# Altium schematic sheet BP_Schematic.SchDoc
size A3; SheetNumber: 1; SheetTotal: 1
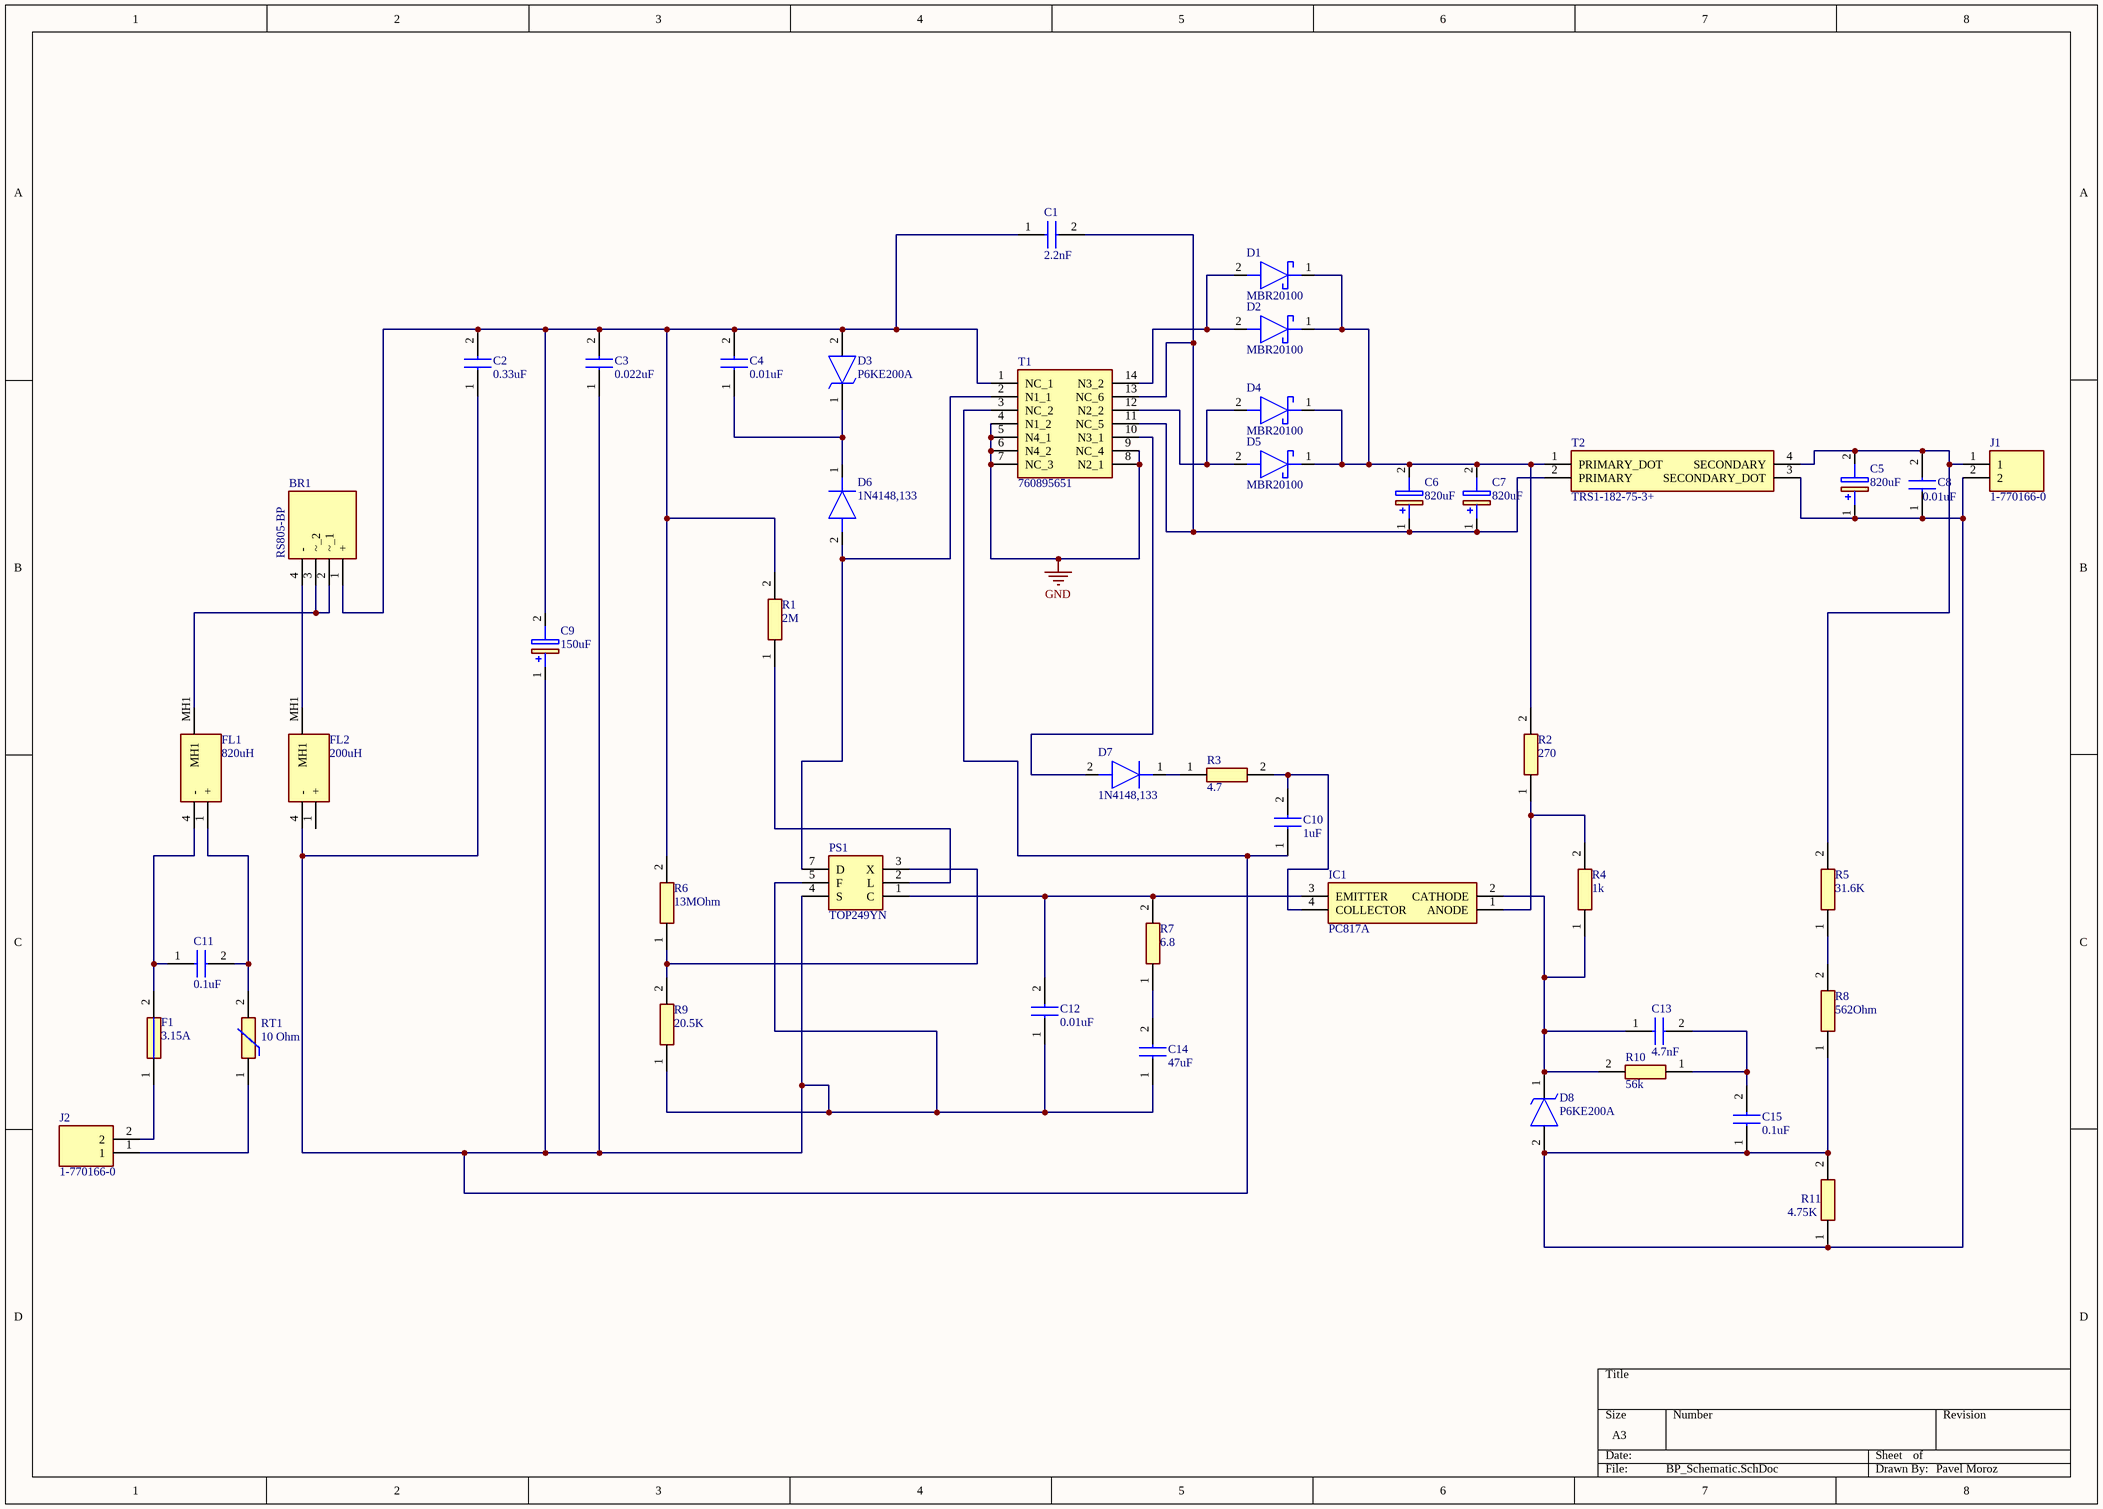
[diagram p0: BP_Schematic.SchDoc]

## Parts
BR1  RS805-BP  [RS805BP]
C1  2.2nF  [GRM21x]
C2  0.33uF  [CAPC9863X510N]
C3  0.022uF  [ECHU_E1_E2_E3_E3a_4]
C4  0.01uF  [GRM21x]
C5  820uF  [T520H]
C6  820uF  [T520H]
C7  820uF  [T520H]
C8  0.01uF  [GRM21x]
C9  150uF  [CAPPM7343X310N]
C10  1uF  [ECQE4105KF]
C11  0.1uF  [CAPC2012X135N]
C12  0.01uF  [GRM21x]
C13  4.7nF  [B32652_(18_x_6)]
C14  47uF  [KR355WD7LG274MH01L]
C15  0.1uF  [B32652_(18_x_6)]
D1  MBR20100  [TO508P485X1018X1930-2P]
D2  MBR20100  [TO508P485X1018X1930-2P]
D3  P6KE200A  [DIOAD1936W88L640D324]
D4  MBR20100  [TO508P485X1018X1930-2P]
D5  MBR20100  [TO508P485X1018X1930-2P]
D6  1N4148,133  [DIOAD1165W56L425D185]
D7  1N4148,133  [DIOAD1165W56L425D185]
D8  P6KE200A  [DIOAD1936W88L640D324]
F1  3.15A  [FUSC12145X450N]
FL1  820uH  [DMT220038L]
FL2  200uH  [DMT220038L]
IC1  PC817A  [DIP762W60P254L458H450Q4N]
J1  1-770166-0  [17701660]
J2  1-770166-0  [17701660]
PS1  TOP249YN  [TOP249YN]
R1  2M  [ERA2AED122X]
R2  270  [ERA2AED122X]
R3  4.7  [ERA3AEB101V]
R4  1k  [ERJUP6]
R5  31.6K  [RESC1005X37N]
R6  13MOhm  [RESC1608X55N]
R7  6.8  [ERA3AEB101V]
R8  562Ohm  [ERJUP6]
R9  20.5K  [ERA2AED122X]
R10  56k  [ERJUP6]
R11  4.75K  [ERA3AEB101V]
RT1  10 Ohm  [10D207LD]
T1  760895651  [760895651]
T2  TRS1-182-75-3+  [TRS1182753]

## Nets
GND: T1.4(N1_2) T1.5(N4_1) T1.6(N4_2) T1.7(NC_3) T1.8(N2_1) T1.9(NC_4)
NetBR1_1: BR1.1(+) C1.1 C2.2 C3.2 C4.2 C9.2(-) D3.2(A) R1.2 R6.2 T1.1(NC_1)
NetBR1_2: BR1.2(~_1) BR1.3(~_2) FL1.MH1
NetBR1_4: BR1.4(-) FL2.MH1
NetC1_2: C1.2 C6.1(+) C7.1(+) T1.11(NC_5) T1.13(NC_6) T2.2(PRIMARY)
NetC2_1: C2.1 C3.1 C9.1(+) C10.1 C12.1 C14.1 FL2.4(-) PS1.4(S) PS1.5(F) R9.1 T1.3(NC_2)
NetC4_1: C4.1 D3.1(K) D6.1(K)
NetC5_1: C5.1(+) C8.1 C15.1 D8.2(A) J1.2 R8.1 R11.1 R11.2 T2.3(SECONDARY_DOT)
NetC5_2: C5.2(-) C8.2 J1.1 R5.2 T2.4(SECONDARY)
NetC6_2: C6.2(-) C7.2(-) D1.1(K) D2.1(K) D4.1(K) D5.1(K) R2.2 T2.1(PRIMARY_DOT)
NetC10_2: C10.2 IC1.4(COLLECTOR) R3.2
NetC11_1: C11.1 F1.2 FL1.4(-)
NetC11_2: C11.2 FL1.1(+) RT1.2
NetC12_2: C12.2 IC1.3(EMITTER) PS1.1(C) R7.2
NetC13_1: C13.1 D8.1(K) IC1.2(CATHODE) R4.1 R10.2
NetC13_2: C13.2 C15.2 R10.1
NetC14_2: C14.2 R7.1
NetD1_2: D1.2(A) D2.2(A) T1.14(N3_2)
NetD4_2: D4.2(A) D5.2(A) T1.12(N2_2)
NetD6_2: D6.2(A) PS1.7(D) T1.2(N1_1)
NetD7_1: D7.1(K) R3.1
NetD7_2: D7.2(A) T1.10(N3_1)
NetF1_1: F1.1 J2.2
NetIC1_1: IC1.1(ANODE) R2.1 R4.2
NetJ2_1: J2.1 RT1.1
NetPS1_2: PS1.2(L) R1.1
NetPS1_3: PS1.3(X) R6.1 R9.2
NetR5_1: R5.1 R8.2

Not connected (* = marked no-connect by the designer): FL2 1(+)

## Notes on the sheet
- Pavel Moroz

## Library data of the parts
BR1 = RS805-BP: Bridge Rectifier; Manufacturer_Name: MCC; Datasheet Link: https://www.mccsemi.com/pdf/Products/RS801-RS807(RS-6).pdf; Height: 19.3mm; Manufacturer_Part_Number: RS805-BP
C1 C4 C8 C12 = GRM21A5C2E222FWA1J: Capacitor; Manufacturer_Name: Murata Electronics; Datasheet Link: https://search.murata.co.jp/Ceramy/image/img/A01X/G101/ENG/GRM21A5C2E222FWA1-01.pdf; Height: 1.25mm; Manufacturer_Part_Number: GRM21A5C2E222FWA1J; Mouser Part Number: 81-RM21A5C2E222FWA1J; Mouser Price/Stock: https://www.mouser.co.uk/ProductDetail/Murata-Electronics/GRM21A5C2E222FWA1J?qs=81r%252BiQLm7BSiEikPutdFnA%3D%3D
C2 = ECW-U2334KCV: Capacitor; Manufacturer_Name: Panasonic; Datasheet Link: https://4donline.ihs.com/images/VipMasterIC/IC/PANA/PANAS16556/PANAS16556-1.pdf?hkey=52A5661711E402568146F3353EA87419; Height: 5.1mm; Manufacturer_Part_Number: ECW-U2334KCV; Mouser Part Number: 667-ECW-U2334KCV; Mouser Price/Stock: https://www.mouser.co.uk/ProductDetail/Panasonic/ECW-U2334KCV?qs=2eTIFwEe529usYuiaSX9EA%3D%3D
C3 = ECW-U2223JC9: Capacitor; Manufacturer_Name: Panasonic; Datasheet Link: http://industrial.panasonic.com/cdbs/www-data/pdf/RDI0000/ABD0000C176.pdf; Manufacturer_Part_Number: ECW-U2223JC9; Mouser Part Number: 667-ECW-U2223JC9; Mouser Price/Stock: https://www.mouser.com/Search/Refine.aspx?Keyword=667-ECW-U2223JC9
C5-C7 = T520H827M010ATE070: Capacitor Polarised; Manufacturer_Name: KEMET; Datasheet Link: https://content.kemet.com/datasheets/KEM_T2076_T52X-530.pdf; Height: 2mm; Manufacturer_Part_Number: T520H827M010ATE070; Mouser Part Number: 80-T520H827M010ATE70; Mouser Price/Stock: https://www.mouser.co.uk/ProductDetail/KEMET/T520H827M010ATE070?qs=f9yNj16SXrKlZOF3KavohA%3D%3D; Arrow Part Number: T520H827M010ATE070; Arrow Price/Stock: https://www.arrow.com/en/products/t520h827m010ate070/kemet-corporation
C9 = 593D157X0010D2TE3: Capacitor Polarised; Manufacturer_Name: Vishay; Datasheet Link: http://www.vishay.com/doc?40005; Height: 3.1mm; Manufacturer_Part_Number: 593D157X0010D2TE3; Mouser Part Number: 74-593D157X0010D2TE3; Mouser Price/Stock: https://www.mouser.co.uk/ProductDetail/Vishay-Sprague/593D157X0010D2TE3?qs=aQP3sjJQQ7Wdjntmkm5NMA%3D%3D
C10 = ECQ-E4105KF: Capacitor; Manufacturer_Name: Panasonic; Datasheet Link: https://industrial.panasonic.com/cdbs/www-data/pdf/RDI0000/ABD0000C179.pdf; Height: 18mm; Manufacturer_Part_Number: ECQ-E4105KF; Mouser Part Number: 667-ECQ-E4105KF; Mouser Price/Stock: https://www.mouser.co.uk/ProductDetail/Panasonic/ECQ-E4105KF?qs=FaGJejDeu%252B%2Fy%2Fa6s5CifsQ%3D%3D; Arrow Part Number: ECQ-E4105KF; Arrow Price/Stock: https://www.arrow.com/en/products/ecq-e4105kf/panasonic?region=nac
C11 = MAASU21GSB7104MTCA01: Capacitor; Manufacturer_Name: TAIYO YUDEN; Datasheet Link: https://ds.yuden.co.jp/TYCOMPAS/ap/detail?pn=MAASU21GSB7104MTCA01&u=M; Height: 1.35mm; Manufacturer_Part_Number: MAASU21GSB7104MTCA01; Mouser Part Number: 963-MAASU21GSB7104M; Mouser Price/Stock: https://www.mouser.co.uk/ProductDetail/TAIYO-YUDEN/MAASU21GSB7104MTCA01?qs=HFfMDpzxxd3%252BHMM46uQdgg%3D%3D
C13 C15 = B32652A1472J000: Capacitor; Manufacturer_Name: TDK; Datasheet Link: https://product.tdk.com/system/files/dam/doc/product/capacitor/film/mkp_mfp/data_sheet/20/20/db/fc_2009/mkp_b32651_658.pdf; Height: 11mm; Manufacturer_Part_Number: B32652A1472J000; Mouser Part Number: 871-B32652A1472J; Mouser Price/Stock: https://www.mouser.co.uk/ProductDetail/EPCOS-TDK/B32652A1472J000?qs=Ff9BYJREiZ5d5E3KH0oh6g%3D%3D
C14 = KRM55WR71H476MH13L: Capacitor; Manufacturer_Name: Murata Electronics; Datasheet Link: https://search.murata.co.jp/Ceramy/image/img/A01X/G101/ENG/KRM55_25V-100V_E.pdf; Manufacturer_Part_Number: KRM55WR71H476MH13L; Mouser Part Number: 81-KRM55WR71H476MH13; Mouser Price/Stock: https://www.mouser.co.uk/ProductDetail/Murata-Electronics/KRM55WR71H476MH13L?qs=xZFQr2mActd1GTa%252BXqK0VQ%3D%3D
D1 D2 D4 D5 = MBR20100: Schottky Diode; Manufacturer_Name: SMC Diode Solutions; Datasheet Link: http://www.smc-diodes.com/propdf/MBR20100%20N0759%20REV.B.pdf; Height: 4.85mm; Manufacturer_Part_Number: MBR20100
D3 D8 = P6KE200A: TVS Diode (Uni-directional); Manufacturer_Name: STMicroelectronics; Datasheet Link: http://www.st.com/web/en/resource/technical/document/datasheet/CD00000720.pdf; Manufacturer_Part_Number: P6KE200A; Mouser Part Number: 511-P6KE200A; Mouser Price/Stock: https://www.mouser.co.uk/ProductDetail/STMicroelectronics/P6KE200A?qs=1B3Q%2FtOggyyKpgFymH4LMw%3D%3D; Arrow Part Number: P6KE200A; Arrow Price/Stock: https://www.arrow.com/en/products/p6ke200a/stmicroelectronics?region=europe
D6 D7 = 1N4148,133: Diode; Manufacturer_Name: Nexperia; Datasheet Link: https://assets.nexperia.com/documents/data-sheet/1N4148_1N4448.pdf; Manufacturer_Part_Number: 1N4148,133; Mouser Part Number: 771-1N4148,133; Mouser Price/Stock: https://www.mouser.co.uk/ProductDetail/Nexperia/1N4148133?qs=elmhQ6eFu7hy8ApvpFxPZg%3D%3D; Arrow Part Number: 1N4148,133; Arrow Price/Stock: https://www.arrow.com/en/products/1n4148133/nxp-semiconductors
F1 = 04643.15DR: Fuse; Manufacturer_Name: LITTELFUSE; Datasheet Link: https://componentsearchengine.com/Datasheets/1/04643.15DR.pdf; Height: 4.5mm; Manufacturer_Part_Number: 04643.15DR; Mouser Part Number: 576-04643.15DR; Mouser Price/Stock: https://www.mouser.com/Search/Refine.aspx?Keyword=576-04643.15DR; Arrow Part Number: 04643.15DR; Arrow Price/Stock: https://www.arrow.com/en/products/04643.15dr/littelfuse
FL1 FL2 = DMT2-200-3.8L: Filter; Manufacturer_Name: COILCRAFT; Datasheet Link: https://componentsearchengine.com/Datasheets/1/DMT2-200-3.8L.pdf; Height: 40.6mm; Manufacturer_Part_Number: DMT2-200-3.8L; Mouser Part Number: 994-DMT2-200-3.8L; Mouser Price/Stock: https://www.mouser.co.uk/ProductDetail/Coilcraft/DMT2-200-3.8L?qs=ZYnrCdKdyedAySmgAr651g%3D%3D
IC1 = PC817A: Integrated Circuit; Manufacturer_Name: Sharp Microelectronics; Datasheet Link: https://pdf1.alldatasheet.com/datasheet-pdf/view/43370/SHARP/PC817A.html; Height: 4.5mm; Manufacturer_Part_Number: PC817A
J1 J2 = 1-770166-0: Connector; Manufacturer_Name: TE Connectivity; Datasheet Link: https://www.te.com/commerce/DocumentDelivery/DDEController?Action=showdoc&DocId=Customer+Drawing%7F770166%7FM%7Fpdf%7FEnglish%7FENG_CD_770166_M.pdf%7F1-770166-0; Height: 14.25mm; Manufacturer_Part_Number: 1-770166-0; Mouser Part Number: 571-1-770166-0; Mouser Price/Stock: https://www.mouser.co.uk/ProductDetail/TE-Connectivity-AMP/1-770166-0?qs=m8myXnDJXpW%252BZqFFniy0cw%3D%3D; Arrow Part Number: 1-770166-0; Arrow Price/Stock: https://www.arrow.com/en/products/1-770166-0/te-connectivity?region=europe
PS1 = TOP249YN: Power Supply; Manufacturer_Name: Power Integrations; Datasheet Link: https://www.power.com/sites/default/files/product-docs/top242.250.pdf; Height: 17.22mm; Manufacturer_Part_Number: TOP249YN; Mouser Part Number: 869-TOP249YN; Mouser Price/Stock: https://www.mouser.co.uk/ProductDetail/Power-Integrations/TOP249YN?qs=ulE8k0yEMYa9hxpa6dExag%3D%3D
R1 R2 = ERA-2ARB271X: Resistor; Manufacturer_Name: Panasonic; Datasheet Link: http://industrial.panasonic.com/cdbs/www-data/pdf/RDM0000/AOA0000C307.pdf; Height: 0.4mm; Manufacturer_Part_Number: ERA-2ARB271X; Mouser Part Number: 667-ERA-2ARB271X; Mouser Price/Stock: https://www.mouser.co.uk/ProductDetail/Panasonic/ERA-2ARB271X?qs=6%252Bc%252B2ke79U5NvXLur4mWNw%3D%3D
R3 R7 R11 = ERA-3ARB4751V: Resistor; Manufacturer_Name: Panasonic; Datasheet Link: https://industrial.panasonic.com/cdbs/www-data/pdf/RDM0000/AOA0000C307.pdf; Height: 0.55mm; Manufacturer_Part_Number: ERA-3ARB4751V; Mouser Part Number: 667-ERA-3ARB4751V; Mouser Price/Stock: https://www.mouser.com/Search/Refine.aspx?Keyword=667-ERA-3ARB4751V
R4 R8 R10 = ERJ-UP6F5620V: Resistor; Manufacturer_Name: Panasonic; Datasheet Link: https://industrial.panasonic.com/cdbs/www-data/pdf/RDP0000/AOA0000C337.pdf; Height: 0.7mm; Manufacturer_Part_Number: ERJ-UP6F5620V
R5 = MCS04020C3162FE000: Resistor; Manufacturer_Name: Vishay; Datasheet Link: http://www.vishay.com/docs/28705/mcx0x0xpro.pdf; Height: 0.37mm; Manufacturer_Part_Number: MCS04020C3162FE000
R6 = RK73B1JTTDD136J: Resistor; Manufacturer_Name: KOA Speer; Datasheet Link: http://www.koaspeer.com/catimages/Products/RK73-RT/RK73-RT.pdf; Height: 0.55mm; Manufacturer_Part_Number: RK73B1JTTDD136J; Mouser Part Number: 660-RK73B1JTTDD136J; Mouser Price/Stock: https://www.mouser.com/Search/Refine.aspx?Keyword=660-RK73B1JTTDD136J
R9 = ERA-2ARB2052X: Resistor; Manufacturer_Name: Panasonic; Datasheet Link: http://industrial.panasonic.com/cdbs/www-data/pdf/RDM0000/AOA0000C307.pdf; Height: 0.4mm; Manufacturer_Part_Number: ERA-2ARB2052X
RT1 = 10D2-07LD: Thermistor; Manufacturer_Name: Semitec; Datasheet Link: https://componentsearchengine.com/Datasheets/1/10D2-07LD.pdf; Height: 13mm; Manufacturer_Part_Number: 10D2-07LD; Mouser Part Number: 954-10D2-07LD; Mouser Price/Stock: https://www.mouser.co.uk/ProductDetail/Semitec/10D2-07LD?qs=wgO0AD0o1vtdKrBfLLBq%2FA%3D%3D
T1 = 760895651: Transformer; Manufacturer_Name: Wurth Elektronik; Datasheet Link: https://www.we-online.com/catalog/datasheet/760895651.pdf; Height: 30mm; Manufacturer_Part_Number: 760895651; Mouser Part Number: 710-760895651; Mouser Price/Stock: https://www.mouser.co.uk/ProductDetail/Wurth-Elektronik/760895651?qs=AAveGqk956G8CHeQSeSJ0w%3D%3D
T2 = TRS1-182-75-3+: Transformer; Manufacturer_Name: Mini-Circuits; Datasheet Link: https://www.minicircuits.com/WebStore/dashboardPdf?model=TRS1-182-75-3%2B; Height: 4.06mm; Manufacturer_Part_Number: TRS1-182-75-3+; Mouser Part Number: 139-TRS1-182-75-3+; Mouser Price/Stock: https://www.mouser.co.uk/ProductDetail/Mini-Circuits/TRS1-182-75-3%2b?qs=Imq1NPwxi744LVUjBx3ybQ%3D%3D